# EAGLE design zeta2rework_lw_v28_rework (EAGLE 9.3.1)
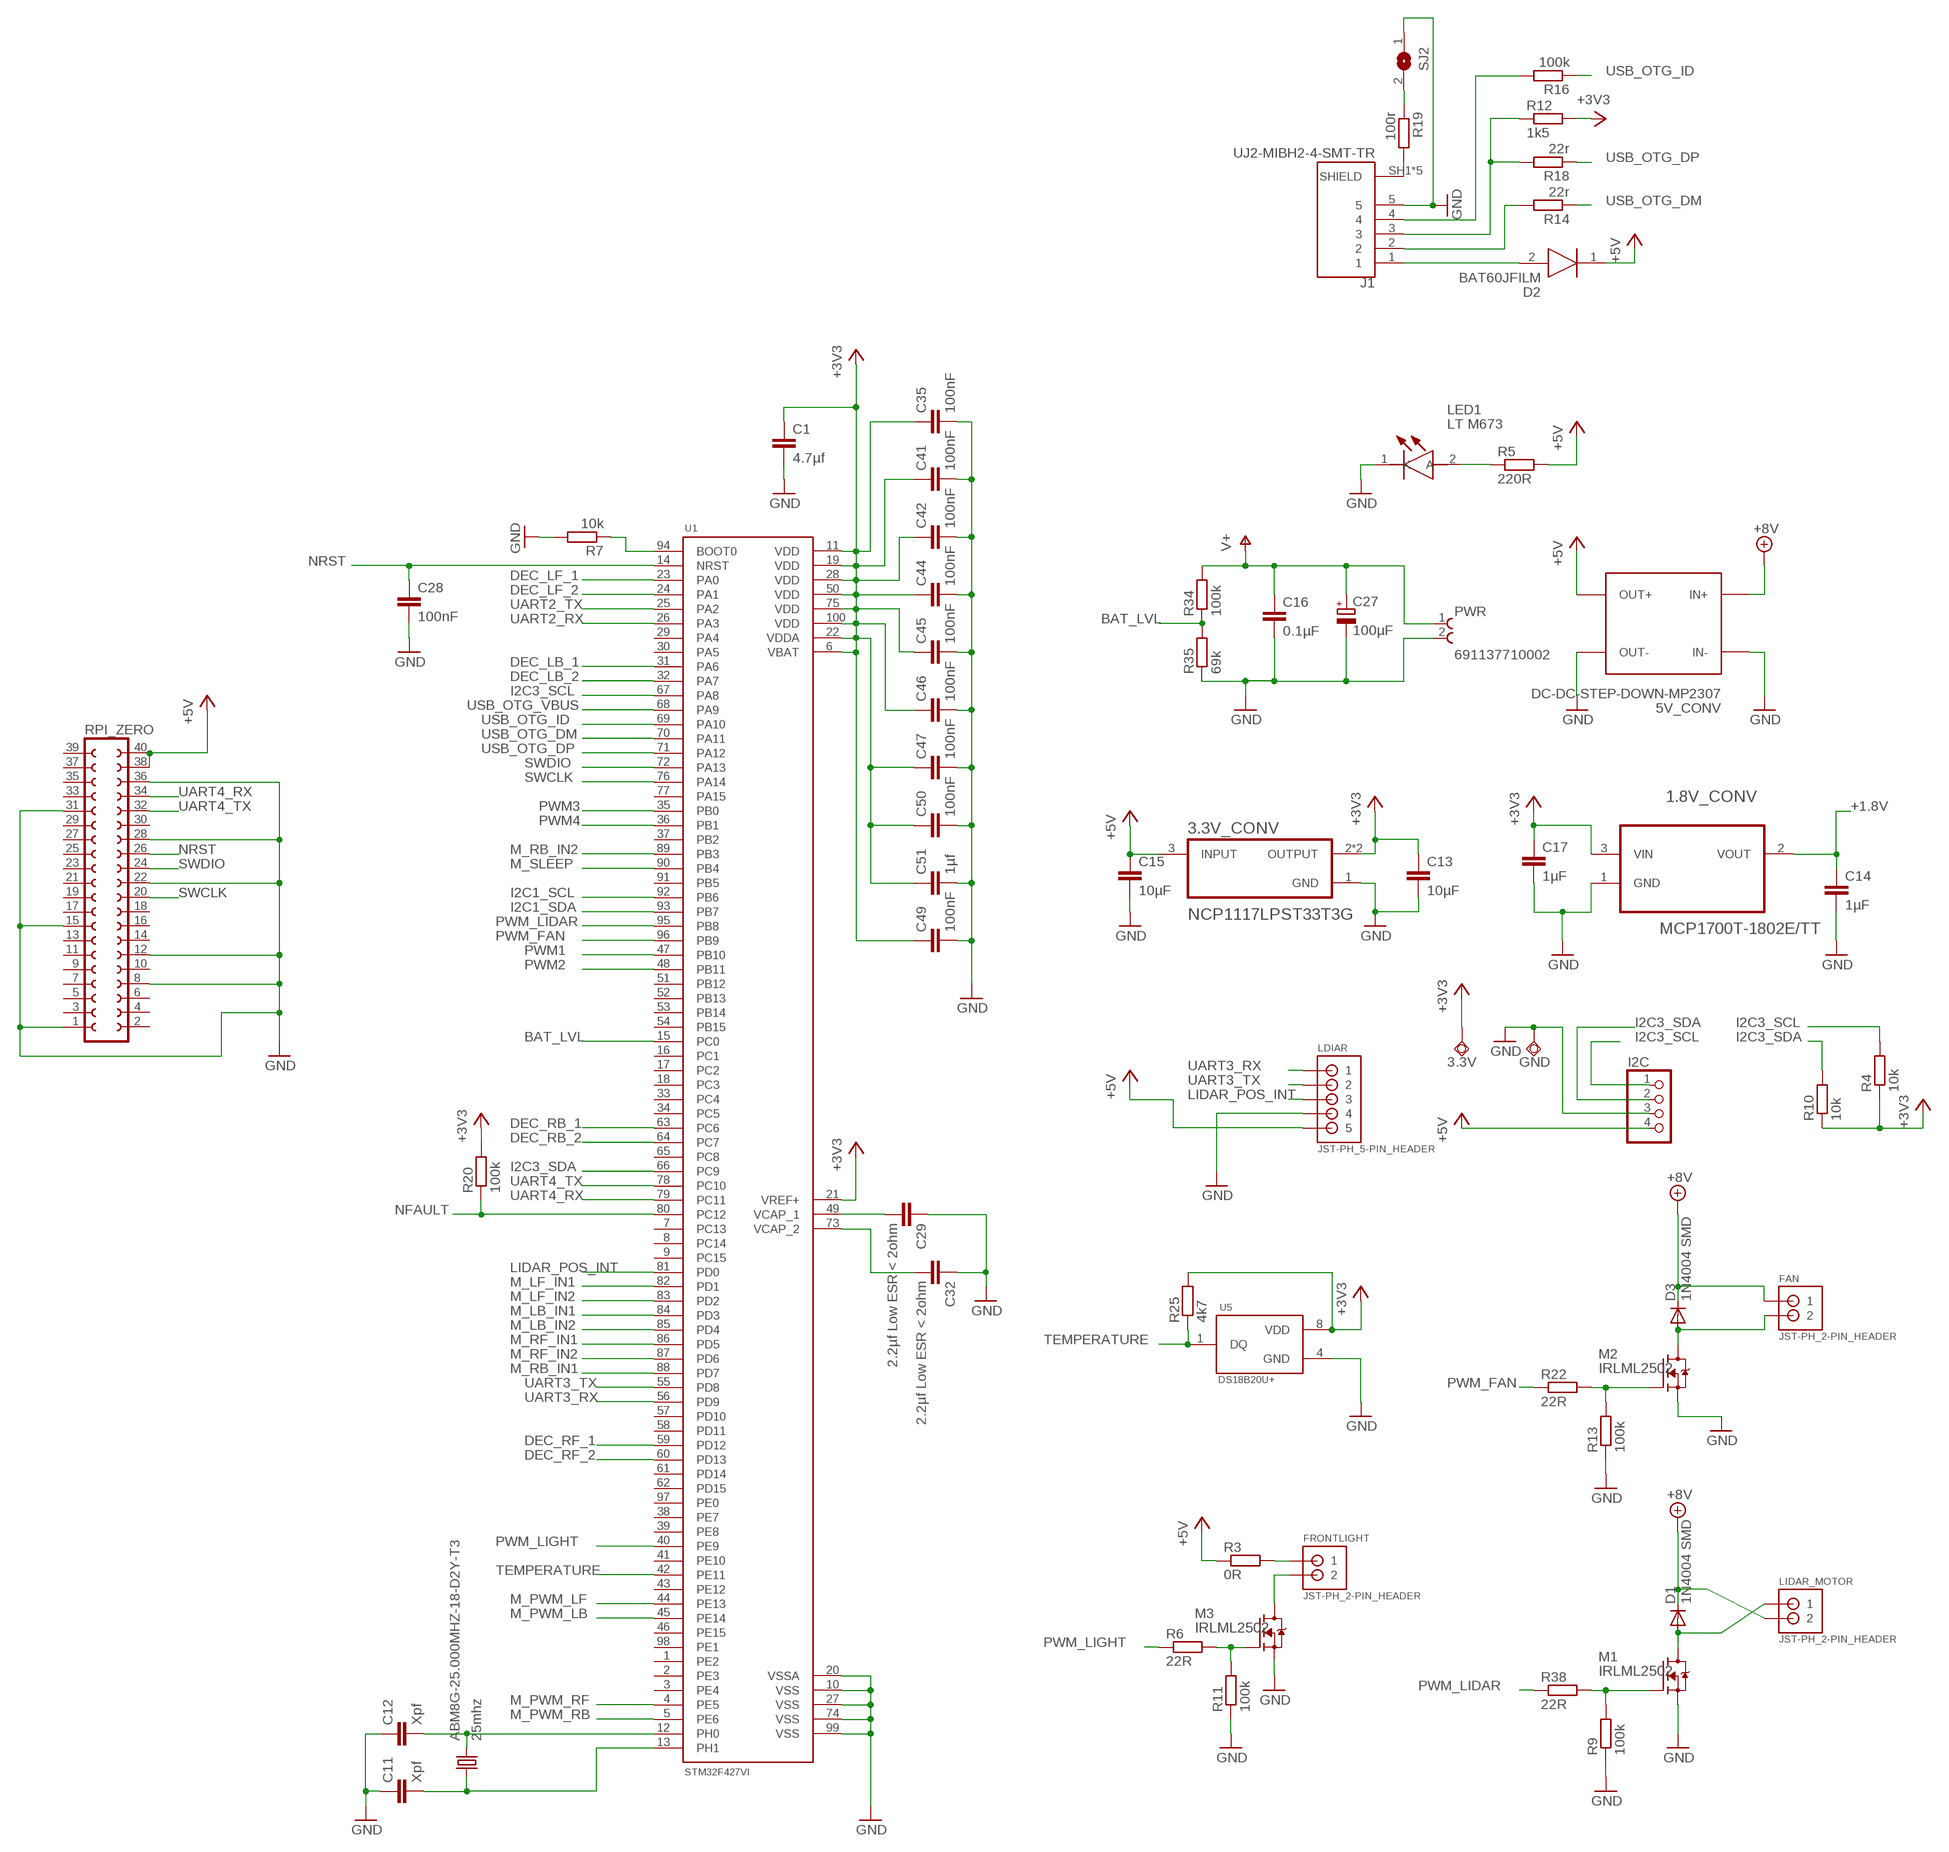
[diagram p0: schematic, sheet 1, part 1 of 2]
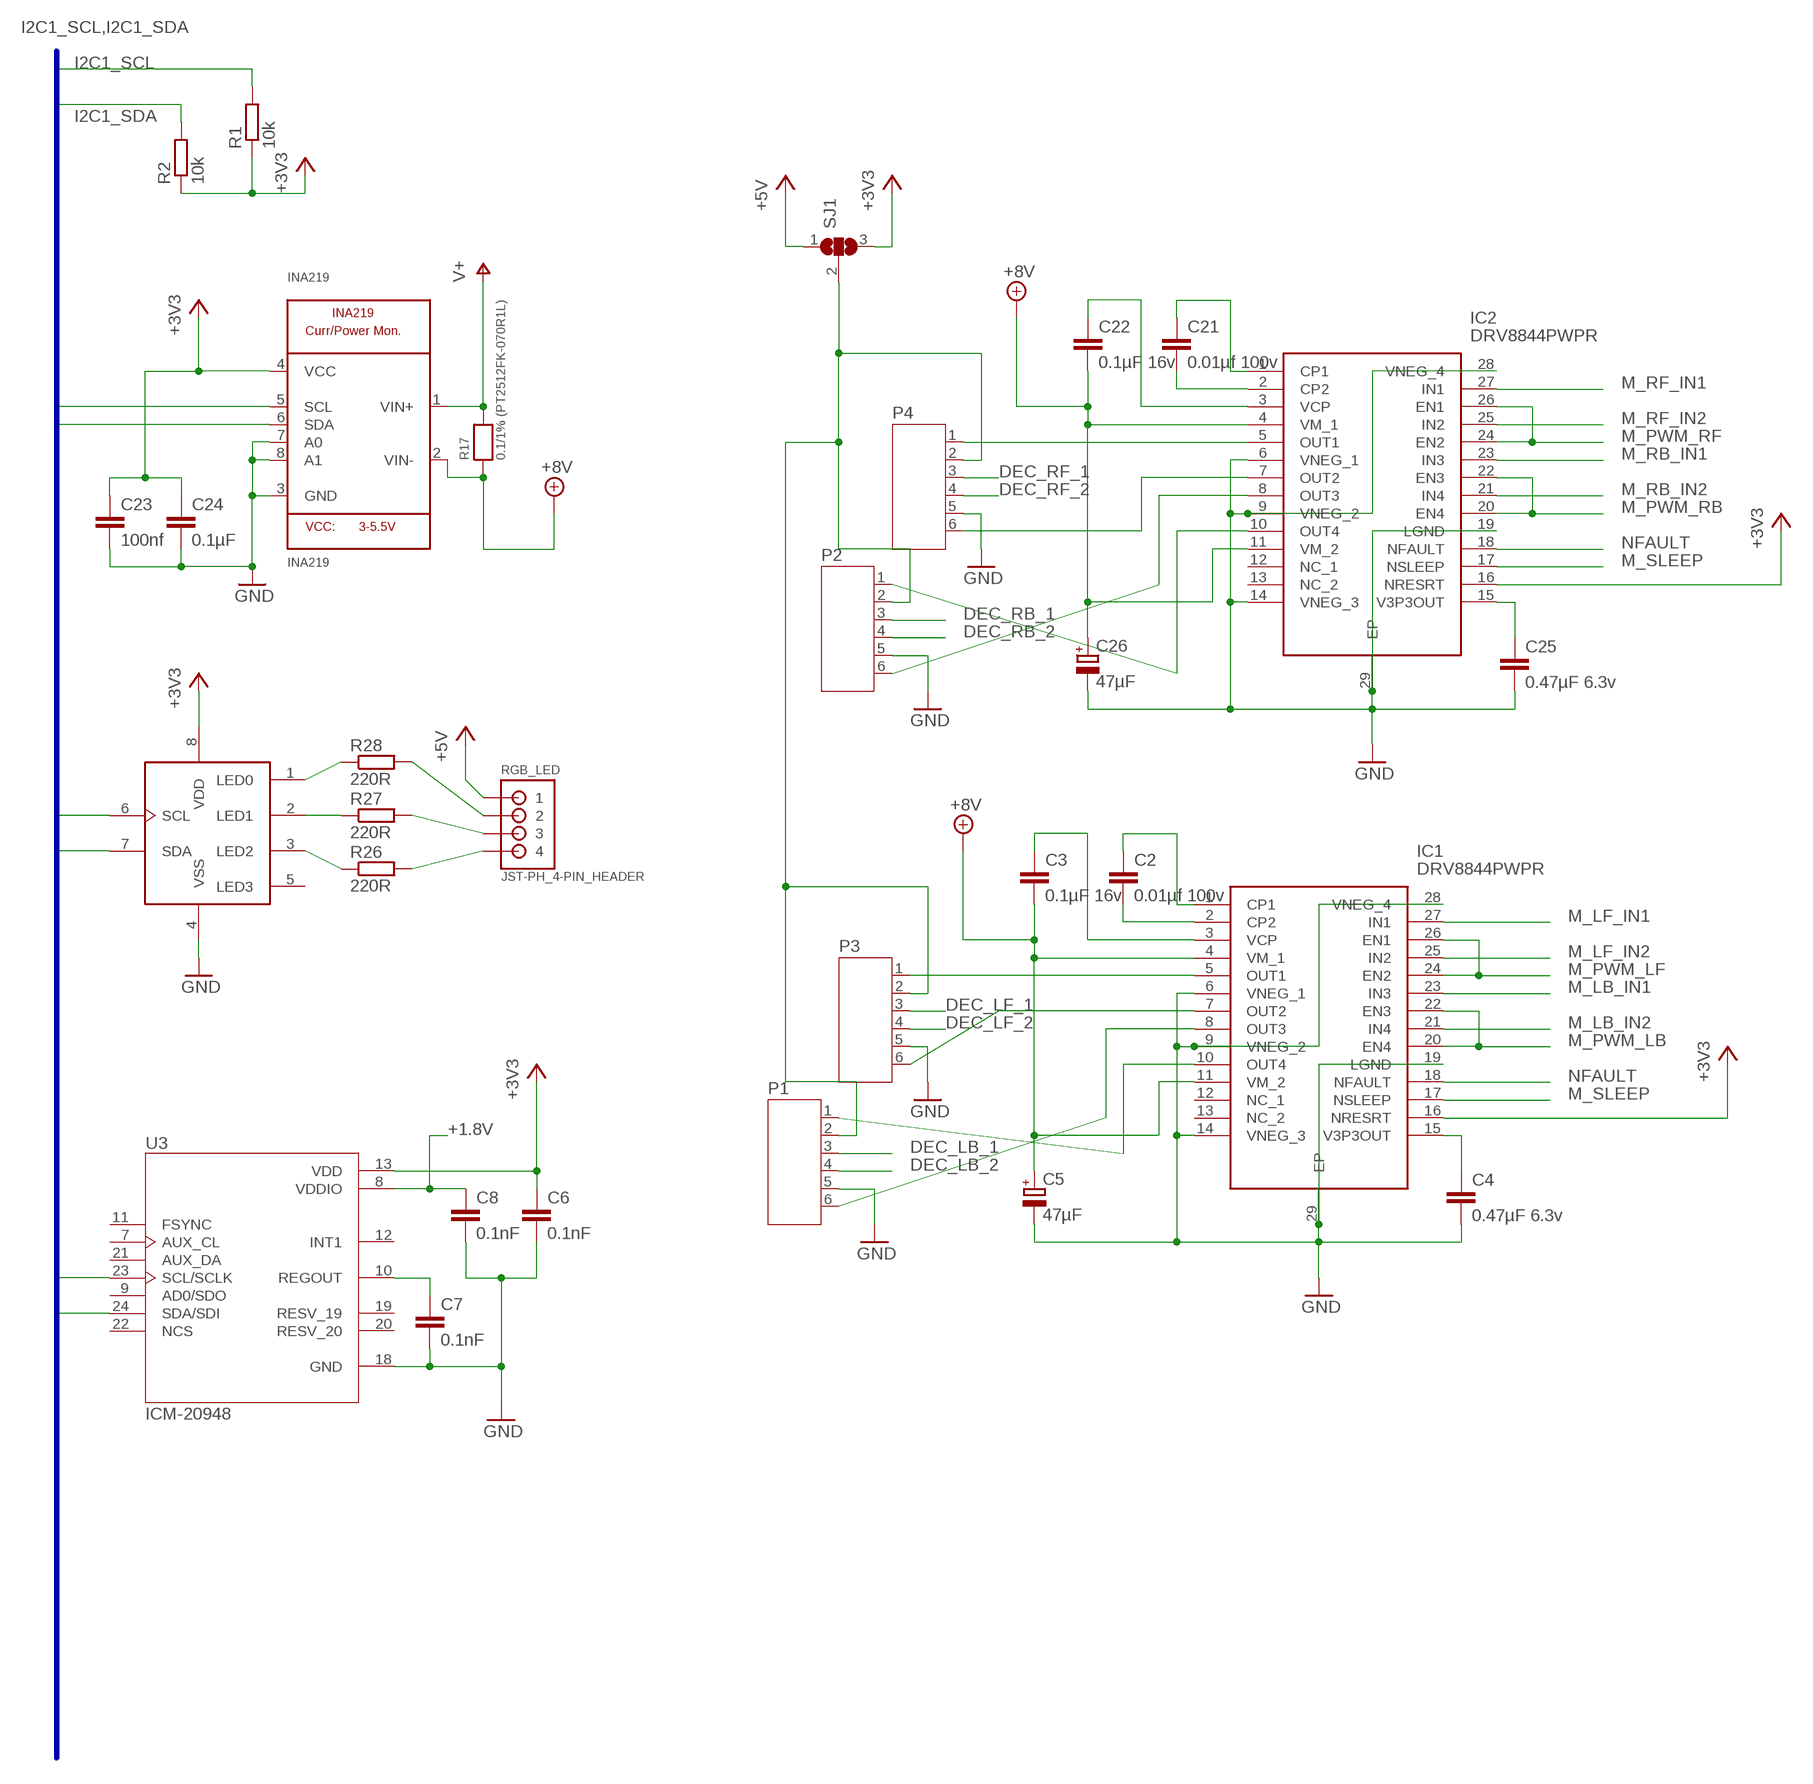
[diagram p1: schematic, sheet 1, part 2 of 2]

## Parts
1.8V_CONV  MCP1700T-1802E/TT  MCP1700T-2102E/TT  [SOT95P237X112-3N]
3.3V  TPSQTP20R  [TP20R]
3.3V_CONV  NCP1117LPST33T3G  [SOT230P700X175-4N]
5V_CONV  DC-DC-STEP-DOWN-MP2307  [DC-DC-STEP-DOWN-MP2307]
ABM8G-25.000MHZ-18-D2Y-T3  25mhz  KX-9A  [5.0X3.2_KX-9A]
C1  4.7µf  C-EUC0603  [C0603]
C2  0.01µf 100v  C-EUC0603  [C0603]
C3  0.1µF 16v  C-EUC0603  [C0603]
C4  0.47µF 6.3v  C-EUC0603  [C0603]
C5  47µF  CPOL-EUUD-5X5,8  [UD-5X5,8_NICHICON]
C6  0.1nF  C-EUC0603  [C0603]
C7  0.1nF  C-EUC0603  [C0603]
C8  0.1nF  C-EUC0603  [C0603]
C11  Xpf  C-EUC0603  [C0603]
C12  Xpf  C-EUC0603  [C0603]
C13  10µF  C-EUC1206  [C1206]
C14  1µF  C-EUC0603  [C0603]
C15  10µF  C-EUC1206  [C1206]
C16  0.1µF  C-EUC0603  [C0603]
C17  1µF  C-EUC0603  [C0603]
C21  0.01µf 100v  C-EUC0603  [C0603]
C22  0.1µF 16v  C-EUC0603  [C0603]
C23  100nf  C-EUC0603  [C0603]
C24  0.1µF  C-EUC0603  [C0603]
C25  0.47µF 6.3v  C-EUC0603  [C0603]
C26  47µF  CPOL-EUUD-5X5,8  [UD-5X5,8_NICHICON]
C27  100µF  CPOL-EUUD-5X5,8  [UD-5X5,8_NICHICON]
C28  100nF  C-EUC0603  [C0603]
C29  2.2µf Low ESR < 2ohm  C-EUC1206  [C1206]
C32  2.2µf Low ESR < 2ohm  C-EUC1206  [C1206]
C35  100nF  C-EUC0603  [C0603]
C41  100nF  C-EUC0603  [C0603]
C42  100nF  C-EUC0603  [C0603]
C44  100nF  C-EUC0603  [C0603]
C45  100nF  C-EUC0603  [C0603]
C46  100nF  C-EUC0603  [C0603]
C47  100nF  C-EUC0603  [C0603]
C49  100nF  C-EUC0603  [C0603]
C50  100nF  C-EUC0603  [C0603]
C51  1µf  C-EUC0603  [C0603]
D1  1N4004 SMD  DIODE-DO214AC  [DO214AC]
D2  BAT60JFILM  [SOD2513X117N]
D3  1N4004 SMD  DIODE-DO214AC  [DO214AC]
FAN  JST-PH_2-PIN_HEADER  [JST_B2B-PH_HEADER]
FRONTLIGHT  JST-PH_2-PIN_HEADER  [JST_B2B-PH_HEADER]
GND  TPSQTP20R  [TP20R]
I2C  PINHD-1X4  [1X04]
IC1  DRV8844PWPR  [SOP65P640X120-29N]
IC2  DRV8844PWPR  [SOP65P640X120-29N]
INA219  INA219  [SOT23-8]
J1  UJ2-MIBH2-4-SMT-TR  [CUI_UJ2-MIBH2-4-SMT-TR]
LDIAR  JST-PH_5-PIN_HEADER  [JST_B5B-PH_HEADER]
LED1  LT M673  LT_M673-N1R2-25  [LTM673-N1R2-25]
LIDAR_MOTOR  JST-PH_2-PIN_HEADER  [JST_B2B-PH_HEADER]
M1  IRLML2502  IRLML2502TRPBF  [SOT23]
M2  IRLML2502  IRLML2502TRPBF  [SOT23]
M3  IRLML2502  IRLML2502TRPBF  [SOT23]
P1  JST-PH6  [JST-PH6]
P2  JST-PH6  [JST-PH6]
P3  JST-PH6  [JST-PH6]
P4  JST-PH6  [JST-PH6]
PCA9533  PCA9533  [SOIC8]
PWR  691137710002  [691137710002]
R1  10k  R-EU_R0603  [R0603]
R2  10k  R-EU_R0603  [R0603]
R3  0R  R-EU_R0603  [R0603]
R4  10k  R-EU_R0603  [R0603]
R5  220R  R-EU_R0603  [R0603]
R6  22R  R-EU_R0603  [R0603]
R7  10k  R-EU_R0603  [R0603]
R9  100k  R-EU_R0603  [R0603]
R10  10k  R-EU_R0603  [R0603]
R11  100k  R-EU_R0603  [R0603]
R12  1k5  R-EU_R0603  [R0603]
R13  100k  R-EU_R0603  [R0603]
R14  22r  R-EU_R0603  [R0603]
R16  100k  R-EU_R0603  [R0603]
R17  0.1/1% (PT2512FK-070R1L)  RESISTOR2512  [2512]
R18  22r  R-EU_R0603  [R0603]
R19  100r  R-EU_R0603  [R0603]
R20  100k  R-EU_R0603  [R0603]
R22  22R  R-EU_R0603  [R0603]
R25  4k7  R-EU_R0603  [R0603]
R26  220R  R-EU_R0603  [R0603]
R27  220R  R-EU_R0603  [R0603]
R28  220R  R-EU_R0603  [R0603]
R34  100k  R-EU_R0603  [R0603]
R35  69k  R-EU_R0603  [R0603]
R38  22R  R-EU_R0603  [R0603]
RGB_LED  JST-PH_4-PIN_HEADER  [JST_B4B-PH_HEADER]
RPI_ZERO  FE20-2  [FE20-2]
SJ1  SJ2W  [SJ_2]
SJ2  SJ  [SJ]
U1  STM32F427VI  STM32F427VGT7  [QFP50P1600X1600X160-100N]
U3  ICM-20948  [QFN40P300X300X105-25N]
U5  DS18B20U+  [SOP65P490X95-8N]

## Nets
+1.8V: 1.8V_CONV.2(VOUT) C8.1 C14.1 U3.8(VDDIO)
+3V3: 1.8V_CONV.3(VIN) 3.3V.TP 3.3V_CONV.2(OUTPUT) 3.3V_CONV.4(OUTPUT) C1.1 C6.1 C13.1 C17.1 C23.1 C24.1 C35.1 C41.1 C42.1 C44.1 C45.1 C46.1 C47.1 C49.1 C50.1 C51.1 IC1.16(NRESRT) IC2.16(NRESRT) INA219.4(VCC) PCA9533.8(VDD) R1.1 R2.1 R4.1 R10.1 R12.2 R20.2 R25.2 SJ1.3 U1.6(VBAT) U1.11(VDD) U1.19(VDD) U1.21(VREF+) U1.22(VDDA) U1.28(VDD) U1.50(VDD) U1.75(VDD) U1.100(VDD) U3.13(VDD) U5.8(VDD)
+5V: 3.3V_CONV.3(INPUT) 5V_CONV.OUT+ C15.1 D2.1(K) I2C.4 LDIAR.P5 R3.1 R5.2 RGB_LED.P1 RPI_ZERO.38 RPI_ZERO.40 SJ1.1
+8V: 5V_CONV.IN+ C3.2 C5.+ C22.2 C26.+ D1.C D3.C FAN.P1 IC1.4(VM_1) IC1.11(VM_2) IC2.4(VM_1) IC2.11(VM_2) INA219.2(VIN-) LIDAR_MOTOR.P2 R17.1
BAT_LVL: R34.1 R35.2 U1.15(PC0)
DEC_LB_1: P1.3 U1.31(PA6)
DEC_LB_2: P1.4 U1.32(PA7)
DEC_LF_1: P3.3 U1.23(PA0)
DEC_LF_2: P3.4 U1.24(PA1)
DEC_RB_1: P2.3 U1.63(PC6)
DEC_RB_2: P2.4 U1.64(PC7)
DEC_RF_1: P4.3 U1.59(PD12)
DEC_RF_2: P4.4 U1.60(PD13)
GND: 1.8V_CONV.1(GND) 3.3V_CONV.1(GND) 5V_CONV.IN- 5V_CONV.OUT- C1.2 C4.2 C5.- C6.2 C7.2 C8.2 C11.1 C12.1 C13.2 C14.2 C15.2 C16.2 C17.2 C23.2 C24.2 C25.2 C26.- C27.- C28.2 C29.1 C32.1 C35.2 C41.2 C42.2 C44.2 C45.2 C46.2 C47.2 C49.2 C50.2 C51.2 GND.TP I2C.3 IC1.6(VNEG_1) IC1.9(VNEG_2) IC1.14(VNEG_3) IC1.19(LGND) IC1.28(VNEG_4) IC1.29(EP) IC2.6(VNEG_1) IC2.9(VNEG_2) IC2.14(VNEG_3) IC2.19(LGND) IC2.28(VNEG_4) IC2.29(EP) INA219.3(GND) INA219.7(A0) INA219.8(A1) J1.5 LDIAR.P4 LED1.1(K) M1.2(S) M2.2(S) M3.2(S) P1.5 P2.5 P3.5 P4.5 PCA9533.4(VSS) PWR.2 R7.2 R9.1 R11.1 R13.1 R35.1 RPI_ZERO.1 RPI_ZERO.8 RPI_ZERO.12 RPI_ZERO.15 RPI_ZERO.22 RPI_ZERO.28 RPI_ZERO.31 RPI_ZERO.36 SJ2.1 U1.10(VSS) U1.20(VSSA) U1.27(VSS) U1.74(VSS) U1.99(VSS) U3.18(GND) U5.4(GND)
I2C1_SCL: INA219.5(SCL) PCA9533.6(SCL) R1.2 U1.92(PB6) U3.23(SCL/SCLK)
I2C1_SDA: INA219.6(SDA) PCA9533.7(SDA) R2.2 U1.93(PB7) U3.24(SDA/SDI)
I2C3_SCL: I2C.1 R4.2 U1.67(PA8)
I2C3_SDA: I2C.2 R10.2 U1.66(PC9)
LIDAR_POS_INT: LDIAR.P3 U1.81(PD0)
M_LB_IN1: IC1.23(IN3) U1.84(PD3)
M_LB_IN2: IC1.21(IN4) U1.85(PD4)
M_LF_IN1: IC1.27(IN1) U1.82(PD1)
M_LF_IN2: IC1.25(IN2) U1.83(PD2)
M_PWM_LB: IC1.20(EN4) IC1.22(EN3) U1.45(PE14)
M_PWM_LF: IC1.24(EN2) IC1.26(EN1) U1.44(PE13)
M_PWM_RB: IC2.20(EN4) IC2.22(EN3) U1.5(PE6)
M_PWM_RF: IC2.24(EN2) IC2.26(EN1) U1.4(PE5)
M_RB_IN1: IC2.23(IN3) U1.88(PD7)
M_RB_IN2: IC2.21(IN4) U1.89(PB3)
M_RF_IN1: IC2.27(IN1) U1.86(PD5)
M_RF_IN2: IC2.25(IN2) U1.87(PD6)
M_SLEEP: IC1.17(NSLEEP) IC2.17(NSLEEP) U1.90(PB4)
N$1: C21.2 IC2.2(CP2)
N$2: C21.1 IC2.1(CP1)
N$3: C22.1 IC2.3(VCP)
N$4: IC2.10(OUT4) P2.1
N$5: J1.3 R12.1 R18.2
N$6: FRONTLIGHT.P1 R3.2
N$7: LED1.2(A) R5.1
N$8: C7.1 U3.10(REGOUT)
N$9: FRONTLIGHT.P2 M3.3(D)
N$10: M3.1(G) R6.2 R11.2
N$11: IC2.5(OUT1) P4.1
N$12: IC2.7(OUT2) P4.6
N$13: ABM8G-25.000MHZ-18-D2Y-T3.1 C11.2 U1.13(PH1)
N$14: IC1.5(OUT1) P3.1
N$15: D2.2(A) J1.1
N$16: R7.1 U1.94(BOOT0)
N$17: J1.4 R16.2
N$18: C2.2 IC1.2(CP2)
N$19: IC2.8(OUT3) P2.6
N$20: C2.1 IC1.1(CP1)
N$21: C3.1 IC1.3(VCP)
N$22: PCA9533.3(LED2) R26.1
N$23: PCA9533.2(LED1) R27.1
N$24: PCA9533.1(LED0) R28.1
N$25: R19.1 SJ2.2
N$26: C25.1 IC2.15(V3P3OUT)
N$27: IC1.7(OUT2) P3.6
N$28: IC1.8(OUT3) P1.6
N$29: C4.1 IC1.15(V3P3OUT)
N$30: IC1.10(OUT4) P1.1
N$31: R26.2 RGB_LED.P4
N$32: P1.2 P2.2 P3.2 P4.2 SJ1.2
N$33: R27.2 RGB_LED.P3
N$34: J1.2 R14.2
N$35: R28.2 RGB_LED.P2
N$36: C29.2 U1.49(VCAP_1)
N$37: M2.1(G) R13.2 R22.2
N$38: M1.1(G) R9.2 R38.2
N$39: D1.A LIDAR_MOTOR.P1 M1.3(D)
N$40: J1.SH1(SHIELD) J1.SH2(SHIELD) J1.SH3(SHIELD) J1.SH4(SHIELD) J1.SH5(SHIELD) R19.2
N$44: ABM8G-25.000MHZ-18-D2Y-T3.3 C12.2 U1.12(PH0)
N$45: C32.2 U1.73(VCAP_2)
N$55: D3.A FAN.P2 M2.3(D)
NFAULT: IC1.18(NFAULT) IC2.18(NFAULT) R20.1 U1.80(PC12)
NRST: C28.1 RPI_ZERO.26 U1.14(NRST)
PWM1: U1.47(PB10)
PWM2: U1.48(PB11)
PWM3: U1.35(PB0)
PWM4: U1.36(PB1)
PWM_FAN: R22.1 U1.96(PB9)
PWM_LIDAR: R38.1 U1.95(PB8)
PWM_LIGHT: R6.1 U1.40(PE9)
SWCLK: RPI_ZERO.20 U1.76(PA14)
SWDIO: RPI_ZERO.24 U1.72(PA13)
TEMPERATURE: R25.1 U1.42(PE11) U5.1(DQ)
UART2_RX: U1.26(PA3)
UART2_TX: U1.25(PA2)
UART3_RX: LDIAR.P1 U1.56(PD9)
UART3_TX: LDIAR.P2 U1.55(PD8)
UART4_RX: RPI_ZERO.34 U1.79(PC11)
UART4_TX: RPI_ZERO.32 U1.78(PC10)
USB_OTG_DM: R14.1 U1.70(PA11)
USB_OTG_DP: R18.1 U1.71(PA12)
USB_OTG_ID: R16.1 U1.69(PA10)
USB_OTG_VBUS: U1.68(PA9)
V+: C16.1 C27.+ INA219.1(VIN+) PWR.1 R17.2 R34.2
Unconnected: IC1.12(NC_1) IC1.13(NC_2) IC2.12(NC_1) IC2.13(NC_2) PCA9533.5(LED3) RPI_ZERO.2 RPI_ZERO.3 RPI_ZERO.4 RPI_ZERO.5 RPI_ZERO.6 RPI_ZERO.7 RPI_ZERO.9 RPI_ZERO.10 RPI_ZERO.11 RPI_ZERO.13 RPI_ZERO.14 RPI_ZERO.16 RPI_ZERO.17 RPI_ZERO.18 RPI_ZERO.19 RPI_ZERO.21 RPI_ZERO.23 RPI_ZERO.25 RPI_ZERO.27 RPI_ZERO.29 RPI_ZERO.30 RPI_ZERO.33 RPI_ZERO.35 RPI_ZERO.37 RPI_ZERO.39 U1.1(PE2) U1.2(PE3) U1.3(PE4) U1.7(PC13) U1.8(PC14) U1.9(PC15) U1.16(PC1) U1.17(PC2) U1.18(PC3) U1.29(PA4) U1.30(PA5) U1.33(PC4) U1.34(PC5) U1.37(PB2) U1.38(PE7) U1.39(PE8) U1.41(PE10) U1.43(PE12) U1.46(PE15) U1.51(PB12) U1.52(PB13) U1.53(PB14) U1.54(PB15) U1.57(PD10) U1.58(PD11) U1.61(PD14) U1.62(PD15) U1.65(PC8) U1.77(PA15) U1.91(PB5) U1.97(PE0) U1.98(PE1) U3.7(AUX_CL) U3.9(AD0/SDO) U3.11(FSYNC) U3.12(INT1) U3.19(RESV_19) U3.20(RESV_20) U3.21(AUX_DA) U3.22(NCS)

## Buses
I2C1_SCL,I2C1_SDA

## Library data of the parts
1.8V_CONV = MCP1700T-2102E_TT:MCP1700T-2102E/TT: Low Quiescent Current LDO; AVAILABILITY: Unavailable; DESCRIPTION: 250mA CMOS LDO, Isupply 1uA and 2% VoutAccuracy; MF: Microchip; MP: MCP1700T-2102E/TT; PACKAGE: SOT-23 Microchip; PRICE: None
3.3V GND = testpad:TPSQ: Test pad
3.3V_CONV = NCP1117LPST33T3G:NCP1117LPST33T3G: None; AVAILABILITY: Unavailable; DESCRIPTION: Linear Voltage Regulator, Positive, LDO, 1.0 A _Fixed and Adjustable_ Vout: 3.3 V; MF: ON Semiconductor; MP: NCP1117LPST33T3G; PACKAGE: SOT-223 ON Semiconductor; PRICE: None
5V_CONV = diy-modules:DC-DC-STEP-DOWN-MP2307: DC/DC Step-Down Regulator based on MP2307DN chip MP2307 datasheet available here: https://cdn-shop.adafruit.com/datasheets/MP2307_r1.9.pdf Click here to find device on ebay.com <http://www.ebay.com/sch/dc+dc+3a+mini+converter>
ABM8G-25.000MHZ-18-D2Y-T3 = crystal-geyer_V1_0:KX: Quartz Crystals (MHz) SMD: KX - Serie Model Size l/w/h [mm] Frequency Range Frequency Stability Temp. Range [°C] Load Capacitance AECQ 200 availabel Datasheet KX-4 KX-5 KX-6 KX-7 KX-9A KX-9B KX-12A KX-12B KX-13 KX-20 KX-K KX-KS 1.6/1.2/0.3 2.0/1.6/0.45 2.5/2.0/0.55 3.2/2.5/0.8 5.0/3.2/1.0 5.0/3.2/1.1 6.0/3.5/1.1 6.0/3.5/1.0 7.0/5.0 /1.3 11.6/5.5/1.6 12.3/4.5/4.2 12.3/4.5/3.2 24.0 ~ 80.0 MHz 16.0 ~ 80.0 MHz 12.0 ~ 80.0 MHz 8.0 ~ 60.0 MHz 7,68 ~ 300,0 MHz 8,0 ~ 50,0 MHz 8,0 ~ 150,0 MHz 8,0 ~ 50,0 MHz 6,0 ~ 160,0 MHz 3,579 ~ 25,0 MHz 3,579 ~ 70,0 MHz 3,579 ~ 70,0 MHz ±10 … ±50ppm ±10 … ±50ppm ±10 … ±50ppm ±10 … ±50ppm ±10 … ±50ppm ±10 … ±50ppm ±10 … ±50ppm ±10 … ±50ppm ±10 … ±50ppm ±50ppm ±10 … ±50ppm ±10 … ±50ppm (*) -40°C …+85°C (*) -40°C …+125°C (*) -40°C …+125°C (*) -40°C …+125°C (*) -40°C …+105°C (*) -40°C …+105°C (*) -40°C …+125°C (*) -40°C …+105°C (*) -40°C …+105°C (*) -40°C …+105°C (*) -40°C …+85°C (*) -40°C …+85°C 8, 8…16 8, 8…16 10, 8…16 12, 7…20 16, 10…20 16, 10…20 16, 10…20 16, 12…20 16, 12…20 16, 12…20 16, 12…30 16, 12…30 - yes yes yes - - - - - - - - KX-4.pdf <http://www.geyer-electronic.de/uploads/tx_userartikelfrequenz/GEYER-KX-4.pdf> KX-5.pdf <http://www.geyer-electronic.de/uploads/tx_userartikelfrequenz/GEYER-KX-5.pdf> KX-6.pdf <http://www.geyer-electronic.de/uploads/tx_userartikelfrequenz/GEYER-KX-6.pdf> KX-7.pdf <http://www.geyer-electronic.de/uploads/tx_userartikelfrequenz/GEYER-KX-7.pdf> KX-9A.pdf <http://www.geyer-electronic.de/uploads/tx_userartikelfrequenz/GEYER-KX-9A.pdf> KX-9B.pdf <http://www.geyer-electronic.de/uploads/tx_userartikelfrequenz/GEYER-KX-9B.pdf> KX-12A.pdf <http://www.geyer-electronic.de/uploads/tx_userartikelfrequenz/GEYER-KX-12A.pdf> KX-12B.pdf <http://www.geyer-electronic.de/uploads/tx_userartikelfrequenz/GEYER-KX-12B.pdf> KX-13.pdf <http://www.geyer-electronic.de/uploads/tx_userartikelfrequenz/GEYER-KX-13.pdf> KX-20.pdf <http://www.geyer-electronic.de/uploads/tx_userartikelfrequenz/GEYER-KX-20.pdf> KX-K.pdf <http://www.geyer-electronic.de/uploads/tx_userartikelfrequenz/GEYER-KX-K.pdf> KX-KS.pdf <http://www.geyer-electronic.de/uploads/tx_userartikelfrequenz/GEYER-KX-KS.pdf> <http://www.geyer-electronic.de/fileadmin/template/img/logo-geyer-electronic.png> Details see: http://www.geyer-electronic.de/Frequenz-Produkte.9.0.html Created 2016-06-07, Hans Locher 2016 (C) Geyer Quartz Technology KX4,KX5,KX6,KX7,KX9A,KX9B,KX12A,KX12B,KX13,KX20,KXK,KXKS;1612;2016;2520;3225;5032;6035;7050;11655;12345;1,6x1,2;2,0x1,6;2,5x2,0;3,2x2,5;5,0x3,2;6,0x3,5;7,0x5,0;11,6x5,5;12,3x4,5;12,3x4,5;1.6x1.2;2.0x1.6;2.5x2.0;3.2x2.5;5.0x3.2;6.0x3.5;7.0x5.0;11.6x5.5;12.3x4.5;12.3x4.5;
C1-C4 C6-C8 C11-C17 C21-C25 C28 C29 C32 C35 C41 C42 C44-C47 C49-C51 = rcl:C-EU: CAPACITOR, European symbol; SPICEPREFIX: C
C5 C26 C27 = rcl:CPOL-EU: POLARIZED CAPACITOR, European symbol; SPICEPREFIX: C
D1 D3 = diode:DIODE-: DIODE
D2 = BAT60JFILM:BAT60JFILM: BAT60JFILM, Schottky Diode, 3A max, 10V, 2-Pin, SOD-323 Source: Datasheet <http://www.st.com/web/en/resource/technical/document/datasheet/CD00001944.pdf>; ALLIED_NUMBER: 70389806; ALLIED_PRICE-STOCK: http://www.alliedelec.com/stmicroelectronics-bat60jfilm/70389806/; DESCRIPTION: BAT60JFILM, Schottky Diode, 3A max, 10V, 2-Pin, SOD-323; HEIGHT: 1.17mm; MANUFACTURER_NAME: STMicroelectronics; MANUFACTURER_PART_NUMBER: BAT60JFILM; MOUSER_PART_NUMBER: 511-BAT60JFILM; MOUSER_PRICE-STOCK: https://www.mouser.com/Search/Refine.aspx?Keyword=511-BAT60JFILM; RS_PART_NUMBER: 1458781; RS_PRICE-STOCK: http://uk.rs-online.com/web/p/products/1458781
FAN FRONTLIGHT LIDAR_MOTOR = srg:JST-PH_2-PIN_HEADER: 2-pin JST PH Shrouded Header, top entry P/N B2B-PH-K-S Mating connector PHR-2 Mating cable assembly: Sparkfun PRT-09914 <http://www.sparkfun.com/products/9914>
I2C = pinhead:PINHD-1X4: PIN HEADER
IC1 IC2 = DRV8844PWPR:DRV8844PWPR: 5A Brushed DC motor or Quad 1.75A Solenoid/Relay Driver with +/-30V split supply support (PWM Ctrl) Source: Datasheet <http://www.ti.com/lit/ds/symlink/drv8844.pdf>; DESCRIPTION: 5A Brushed DC motor or Quad 1.75A Solenoid/Relay Driver with +/-30V split supply support (PWM Ctrl); HEIGHT: 1.2mm; MANUFACTURER_NAME: Texas Instruments; MANUFACTURER_PART_NUMBER: DRV8844PWPR; MOUSER_PART_NUMBER: 595-DRV8844PWPR; MOUSER_PRICE-STOCK: https://www.mouser.com/Search/Refine.aspx?Keyword=595-DRV8844PWPR
INA219 = INA219:INA219: INA219 - I2C Current/Power Monitor Voltage Range: 0-26V Accuracy: 0.5% Temperature: -40°C - 125°C; AVAILABILITY: Unavailable; DESCRIPTION: the ina219 is a high-side current shunt and power monitor with an i2c interface. the ina219 monitors both shunt drop ...; MF: Texas Instruments; MP: INA219; PACKAGE: None; PRICE: None
J1 = UJ2-MIBH2-4-SMT-TR:UJ2-MIBH2-4-SMT-TR: Micro B Type 5 Pin Horizontal 30 µin Plating SMT USB Jack 2.0; AVAILABILITY: Unavailable; CUI_PURCHASE_URL: https://www.cui.com/product/interconnect/usb-connectors/micro-b/uj2-mibh2-4-smt?utm_source=snapeda.com&utm_medium=referral&utm_campaign=snapedaBOM; DESCRIPTION: Micro B Type 5 Pin Horizontal 30 µin Plating SMT USB Jack 2.0; MF: CUI Inc.; MP: UJ2-MIBH2-4-SMT-TR; PACKAGE: None; PRICE: None
LDIAR = srg:JST-PH_5-PIN_HEADER: 5-pin JST PH Shrouded Header, top entry P/N B5B-PH-K-S Mating connector PHR-5 Mating cable assembly: Sparkfun PRT-09917 <http://www.sparkfun.com/products/9917>
LED1 = LT_M673-N1R2-25:LT_M673-N1R2-25: Osram Opto LT M673-N1R2-25, Mini TOPLED Series Green LED, 529 nm,, Rectangle Lens SMD Package Source: Datasheet <https://www.osram-os.com/Graphics/XPic0/00252812_0.pdf/LT M673.pdf>; DESCRIPTION: Osram Opto LT M673-N1R2-25, Mini TOPLED Series Green LED, 529 nm,, Rectangle Lens SMD Package; HEIGHT: mm; MANUFACTURER_NAME: OSRAM Opto Semiconductors; MANUFACTURER_PART_NUMBER: LT M673-N1R2-25; MOUSER_PART_NUMBER: 720-LTM673N1R225Z; MOUSER_PRICE-STOCK: https://www.mouser.com/Search/Refine.aspx?Keyword=720-LTM673N1R225Z; RS_PART_NUMBER: 9133231; RS_PRICE-STOCK: http://uk.rs-online.com/web/p/products/9133231
M1-M3 = IRLML2502TRPBF:IRLML2502TRPBF; AVAILABILITY: Unavailable; DESCRIPTION: Single N-Channel 20 V 0.08 Ohm 12 nC 1.25 W Silicon SMT Mosfet - SOT-23; MF: Infineon; MP: IRLML2502TRPBF; PACKAGE: SOT-23-3 Infineon; PRICE: None
P1-P4 = jst-ph:JST-PH6
PCA9533 = adam - ics:PCA9533: PCA9533D/01: LED driver and dimmer 4 channel, PWM @ 8 bit resolution 25mA / channel sink external resistors per LED I2C protocol @ 400kHz (fast) digikey: 568-3372-5-ND, 8-SOIC, $1.92
PWR = term block:691137710002: SERIE 1377 - 5.00 MM - HORIZONTAL CABLE ENTRY WITH PRESSURE CLAMP - GLOW WIRE PLASTIC - WR-TBL <http://katalog.we-online.de/media/images/v2/Family_WR-TBL1_6911377100xx.jpg> Details see: http://katalog.we-online.de/en/em/TBL_5_00_1377_HORIZONTAL_ENTRY_W_PRESSURE_CLAMP_GLOW_WIRE_6911377100xx Created by Yingchun,Shan 2016(C) Wurth Elektronik; AVAILABILITY: Unavailable; DESCRIPTION: Term Block 2pos Side Entry 5mm; MF: Wurth Electronics; MP: 691137710002; PACKAGE: None; PRICE: None
R1-R7 R9-R14 R16 R18-R20 R22 R25-R28 R34 R35 R38 = rcl:R-EU_: RESISTOR, European symbol; SPICEPREFIX: R
R17 = microbuilder:RESISTOR: Resistors 0402 - 0402 Surface Mount Package 22 Ohm 1% 1/16W [Digikey: 311-22.0LRTR-ND] 33 Ohm 5% 1/16W 1.0K 5% 1/16W 1.5K 5% 1/16W 2.0K 1% 1/16W 10.0K 1% 1/16W [Digikey: 311-10.0KLRTR-ND] 10.0K 5% 1/16W [Digikey: RMCF0402JT10K0TR-ND] 12.1K 1% 1/16W [Digikey: 311-22.0LRTR-ND] 100.0K 5% 1/16W 0603 - 0603 Surface Mount Package 0 Ohm 1/10 Watt 1% Resistor 15 Ohm 1/10 Watt 1% Resistor 33 Ohm 1/10 Watt 1% Resistor 49.9 Ohm 1/10 Watt 1% Resistor 100 Ohm 1/10 Watt 1% Resistor 150 Ohm 1/10 Watt 1% Resistor 240 Ohm 1/10 Watt 1% Resistor 390 Ohm 1/10 Watt 1% Resistor 560 Ohm 1/10 Watt 1% Resistor 680 Ohm 1/10 Watt 1% Resistor 750 Ohm 1/10 Watt 1% Resistor 1.0K Ohm 1/10 Watt 1% Resistor 1.5K Ohm 1/10 Watt 1% Resistor 2.0K Ohm 1/10 Watt 1% Resistor 2.2K Ohm 1/10 Watt 1% Resistor 3.3K Ohm 1/10 Watt 1% Resistor 4.7K Ohm 1/10 Watt 1% Resistor 10.0K Ohm 1/10 Watt 1% Resistor 12.0K Ohm 1/10 Watt 1% Resistor 12.1K Ohm 1/10 Watt 1% Resistor 20.0K Ohm 1/10 Watt 1% Resistor 33.0K Ohm 1/10 Watt 1% Resistor 100.0K Ohm 1/10 Watt 1% Resistor 0805 - 0805 Surface Mount Package 0 Ohm 1/8 Watt 1% Resistor 33 Ohm 1/8 Watt 1% Resistor 100 Ohm 1/8 Watt 1% Resistor 150 Ohm 1/8 Watt 1% Resistor 200 Ohm 1/8 Watt 1% Resistor 240 Ohm 1/8 Watt 1% Resistor 330 Ohm 1/8 Watt 1% Resistor 390 Ohm 1/8 Watt 1% Resistor 470 Ohm 1/8 Watt 1% Resistor 1.0K Ohm 1/8 Watt 1% Resistor 1.5K Ohm 1/8 Watt 1% Resistor 2.0K Ohm 1/8 Watt 1% Resistor 4.7K Ohm 1/8 Watt 1% Resistor 5.1K Ohm 1/8 Watt 1% Resistor 5.6K Ohm 1/8 Watt 1% Resistor 10.0K Ohm 1/8 Watt 1% Resistor 22.0K Ohm 1/8 Watt 1% Resistor 33.0K Ohm 1/8 Watt 1% Resistor 100K Ohm 1/8 Watt 1% Resistor 1206 - 1206 Surface Mount Package 2012 - 2010 Surface Mount Package 0.11 Ohm 1/2 Watt 1% Resistor - Digikey: RHM.11UCT-ND
RGB_LED = srg:JST-PH_4-PIN_HEADER: 4-pin JST PH Shrouded Header, top entry P/N B4B-PH-K-S Mating connector PHR-4 Mating cable assembly: Sparkfun PRT-09916 <http://www.sparkfun.com/products/9916>
RPI_ZERO = con-lsta:FE20-2: FEMALE HEADER; OC_FARNELL: unknown; OC_NEWARK: unknown
SJ1 = jumper:SJ2W: SMD solder JUMPER
SJ2 = jumper:SJ: SMD solder JUMPER
U1 = STM32F427VGT7:STM32F427VGT7: MCU 32-bit STM32F ARM Cortex M4 RISC 1024KB Flash 2.5V/3.3V 100-Pin LQFP Tray; AVAILABILITY: Unavailable; DESCRIPTION: Ic Mcu 32bit 1mb Flash 100lqfp; MF: STMicroelectronics; MP: STM32F427VGT7; PACKAGE: LQFP-100 STMicroelectronics; PRICE: None
U3 = ICM-20948:ICM-20948: Axis=3 Axis Gyro+3 Axis Accel+Compass. Pin For Pin With m; AVAILABILITY: Unavailable; DESCRIPTION: 9 Axis=3 Axis Gyro+3 Axis Accel+Compass. Pin For Pin With m; MF: TDK InvenSense; MP: ICM-20948; PACKAGE: QFN-24 InvenSense; PRICE: None
U5 = DS18B20U_:DS18B20U+: Board Mount Temperature Sensors Prgmble Resolution 1-Wire Parasite Pwr; AVAILABILITY: Unavailable; DESCRIPTION: Date Code: 1043+; RoHS Compliant: Yes;; MF: Maxim; MP: DS18B20U+; PACKAGE: TSSOP-8 Chip Coolers; PRICE: None

## Net classes
0 default: clearance 0.152 mm

## Board
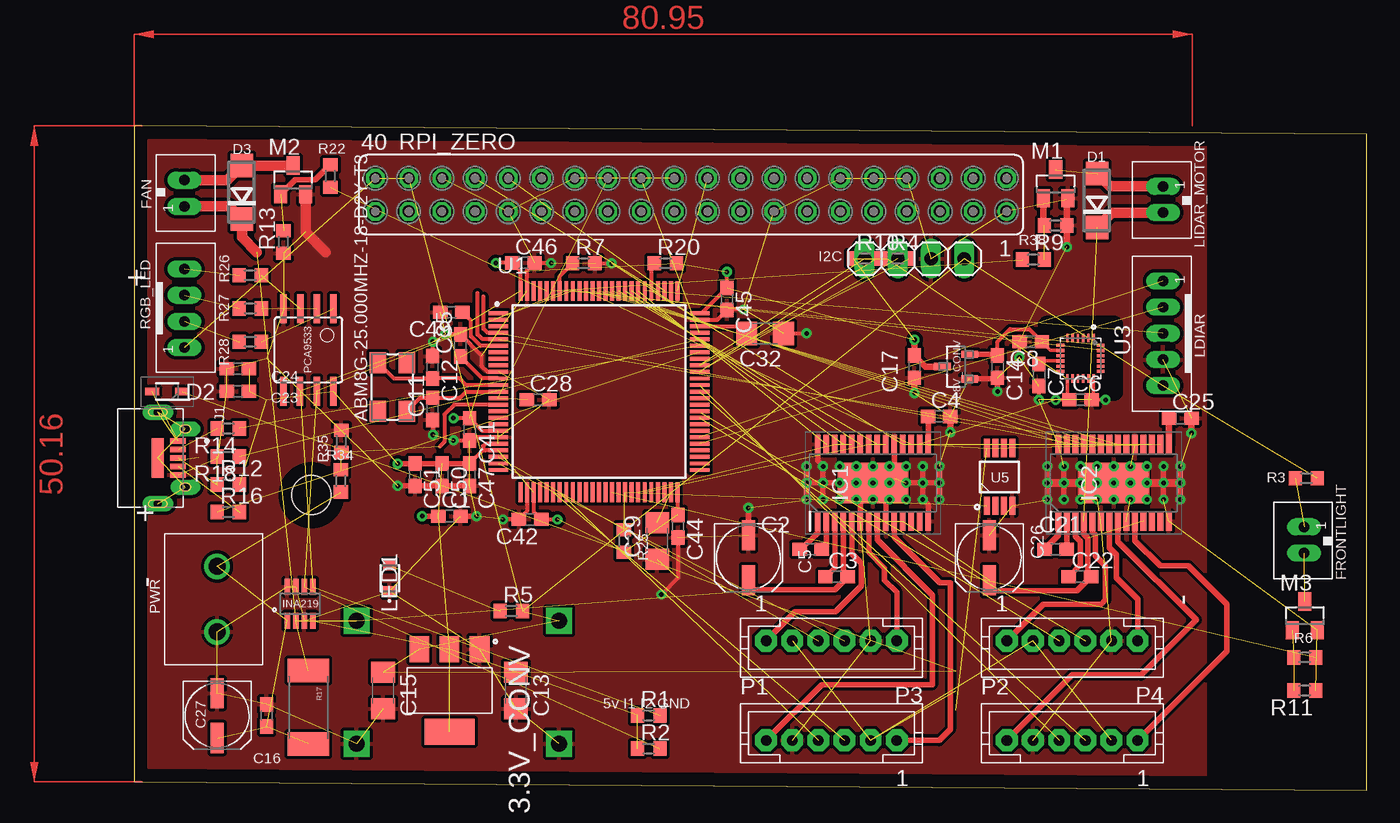
[diagram p2: board, top side]
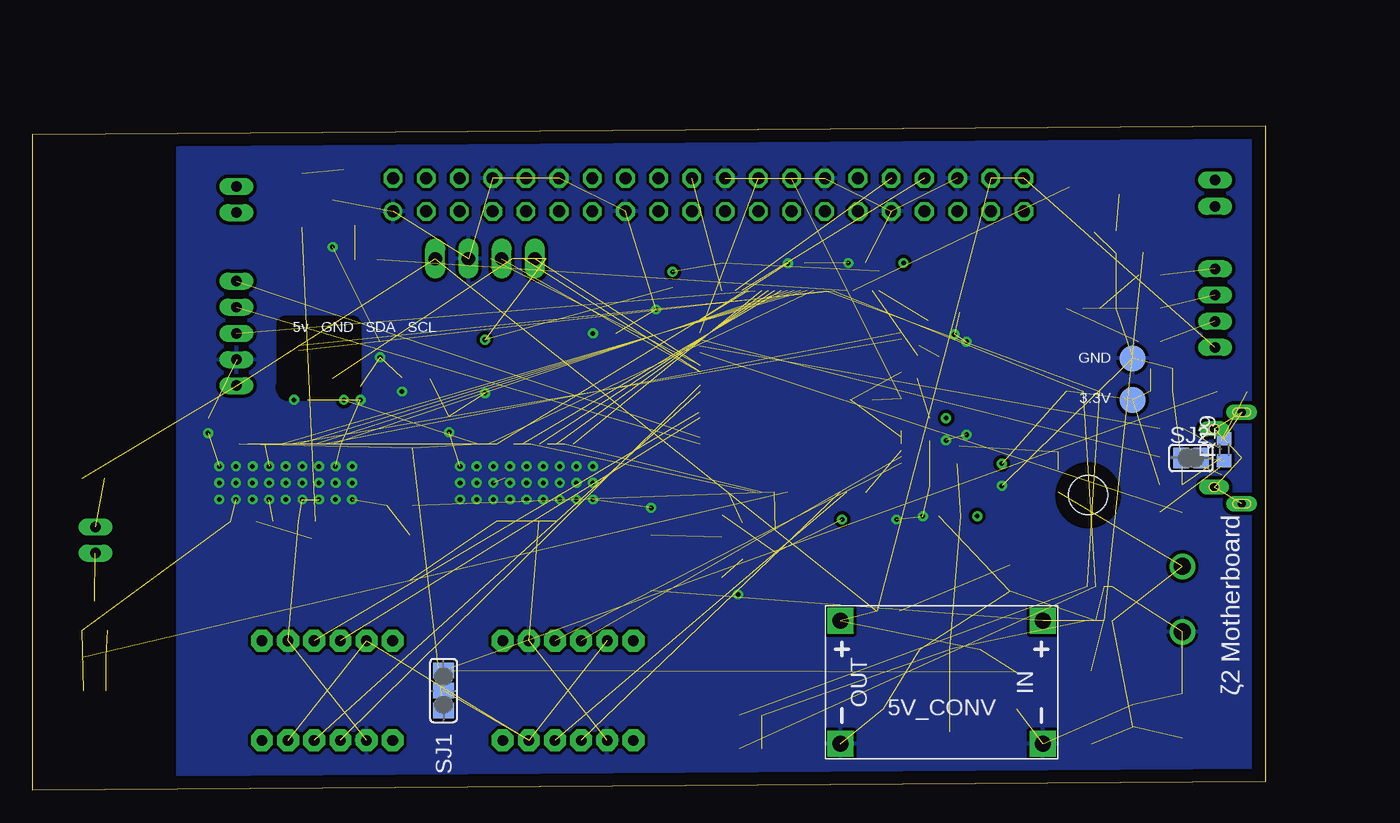
[diagram p3: board, bottom side, seen from below]

Size 94.29 x 50.79 mm. Coordinates in mm from the lower left corner, seen from the top.
Outline: 0,0.64 94.29,0 94.29,50.16 0,50.79 0,0.64
Copper layers (1+2*15+16): Top 0.035mm / dielectric 1.5mm / Route2 0.035mm / dielectric 0.15mm / Route15 0.035mm / dielectric 0.2mm / Bottom 0.035mm
Design rules "default *": minimum track width 6mil, minimum drill 0.35mm, track to track 6mil, track to pad 6mil, pad to pad 6mil, via to via 6mil, smd to smd 6mil, copper to edge 40mil, drill to drill 6mil, minimum pad ring 10mil, minimum via ring 8mil, stop-mask expansion 4mil, vias tented up to drill 0mil, thermal gap 10mil
Holes 3 mm at 13.56,22.56

### Footprints (pad centres in the part's own frame; a part is rotated, then mirrored left to right if it is on the bottom)
SOT95P237X112-3N = smd 0.559 x 1.27: 1 -0.94,-1.041; 2 0.94,-1.041; 3 0,1.041
TP20R = smd 2 x 2: TP 0,0
SOT230P700X175-4N = smd 2 x 1.5: 1 -3.15,2.3; 2 -3.15,0; 3 -3.15,-2.3 | smd 2 x 3.8: 4 3.15,0
DC-DC-STEP-DOWN-MP2307 = drill 1.2 pad 2 square: IN+ -7.747,-4.699; IN- -7.747,4.699; OUT+ 7.747,-4.699; OUT- 7.747,4.699
5.0X3.2_KX-9A = smd 1.6 x 1.25: 1 -1.85,-1.1; 2 1.85,-1.1; 3 1.85,1.1; 4 -1.85,1.1
C0603 = smd 1.1 x 1: 1 -0.85,0; 2 0.85,0
UD-5X5,8_NICHICON = smd 2.3 x 1: + 1.725,0; - -1.7,0
C1206 = smd 1.6 x 1.8: 1 -1.4,0; 2 1.4,0
DO214AC = smd 1.8 x 1.7: A 2.05,0; C -2.05,0
SOD2513X117N = smd 1.085 x 0.55: 1 -1.14,0; 2 1.14,0
JST_B2B-PH_HEADER = drill 0.8 long: P1 1.075,0.048; P2 -0.925,0.048
1X04 = drill 1.016 long: 1 -3.81,0; 2 -1.27,0; 3 1.27,0; 4 3.81,0
SOP65P640X120-29N = smd 1.475 x 0.45: 1 -2.938,4.225; 2 -2.938,3.575; 3 -2.938,2.925; 4 -2.938,2.275; 5 -2.938,1.625; 6 -2.938,0.975; 7 -2.938,0.325; 8 -2.938,-0.325; 9 -2.938,-0.975; 10 -2.938,-1.625; 11 -2.938,-2.275; 12 -2.938,-2.925; 13 -2.938,-3.575; 14 -2.938,-4.225; 15 2.938,-4.225; 16 2.938,-3.575; 17 2.938,-2.925; 18 2.938,-2.275; 19 2.938,-1.625; 20 2.938,-0.975; 21 2.938,-0.325; 22 2.938,0.325; 23 2.938,0.975; 24 2.938,1.625; 25 2.938,2.275; 26 2.938,2.925; 27 2.938,3.575; 28 2.938,4.225 | smd 3.1 x 5.18: 29 0,0
SOT23-8 = smd 0.4 x 1.2: 1 -0.975,-1.3; 2 -0.325,-1.3; 3 0.325,-1.3; 4 0.975,-1.3; 5 0.975,1.3; 6 0.325,1.3; 7 -0.325,1.3; 8 -0.975,1.3
CUI_UJ2-MIBH2-4-SMT-TR = smd 0.4 x 1.2: 1 -1.3,2.1; 2 -0.65,2.1; 3 0,2.1; 4 0.65,2.1; 5 1.3,2.1 | drill 0.6 pad 1.2 long: SH1 -3.5,0.55; SH4 3.5,0.55 | drill 0.65 pad 1.1 long: SH2 -2.225,2.65; SH3 2.225,2.65 | smd 3 x 0.9: SH5 0,0.55
JST_B5B-PH_HEADER = drill 0.8 long: P1 4,0.048; P2 2,0.048; P3 0,0.048; P4 -2,0.048; P5 -4,0.048
LTM673-N1R2-25 = smd 0.8 x 1: 1 -1,0; 2 1,0
SOT23 = smd 1 x 1.4: 1 -0.95,-1.1; 2 0.95,-1.1; 3 0,1.1
JST-PH6 = drill 0.813 pad 1.676 octagon: 1 5,0; 2 3,0; 3 1,0; 4 -1,0; 5 -3,0; 6 -5,0
SOIC8 = smd 0.5 x 2.2: 1 -1.905,-3.154; 2 -0.645,-3.154; 3 0.625,-3.154; 4 1.895,-3.154; 5 1.905,3.154; 6 0.635,3.154; 7 -0.635,3.154; 8 -1.905,3.154
691137710002 = drill 1.3: 1 -2.5,0; 2 2.5,0
R0603 = smd 1 x 1.1: 1 -0.85,0; 2 0.85,0
2512 = smd 1.8 x 3.2: 1 -2.8,0; 2 2.8,0
JST_B4B-PH_HEADER = drill 0.8 long: P1 2.98,0.048; P2 0.98,0.048; P3 -1.02,0.048; P4 -3.02,0.048
FE20-2 = drill 0.914: 1 -24.13,1.27 | drill 0.914 octagon: 2 -24.13,-1.27; 3 -21.59,1.27; 4 -21.59,-1.27; 5 -19.05,1.27; 6 -19.05,-1.27; 7 -16.51,1.27; 8 -16.51,-1.27; 9 -13.97,1.27; 10 -13.97,-1.27; 11 -11.43,1.27; 12 -11.43,-1.27; 13 -8.89,1.27; 14 -8.89,-1.27; 15 -6.35,1.27; 16 -6.35,-1.27; 17 -3.81,1.27; 18 -3.81,-1.27; 19 -1.27,1.27; 20 -1.27,-1.27; 21 1.27,1.27; 22 1.27,-1.27; 23 3.81,1.27; 24 3.81,-1.27; 25 6.35,1.27; 26 6.35,-1.27; 27 8.89,1.27; 28 8.89,-1.27; 29 11.43,1.27; 30 11.43,-1.27; 31 13.97,1.27; 32 13.97,-1.27; 33 16.51,1.27; 34 16.51,-1.27; 35 19.05,1.27; 36 19.05,-1.27; 37 21.59,1.27; 38 21.59,-1.27; 39 24.13,1.27; 40 24.13,-1.27
SJ_2 = smd 1.168 x 1.6: 1 -1.524,0; 2 0,0; 3 1.524,0
SJ = smd 1.168 x 1.6: 1 -0.762,0; 2 0.762,0
QFP50P1600X1600X160-100N = smd 1.5 x 0.3: 1 -7.7,6; 2 -7.7,5.5; 3 -7.7,5; 4 -7.7,4.5; 5 -7.7,4; 6 -7.7,3.5; 7 -7.7,3; 8 -7.7,2.5; 9 -7.7,2; 10 -7.7,1.5; 11 -7.7,1; 12 -7.7,0.5; 13 -7.7,0; 14 -7.7,-0.5; 15 -7.7,-1; 16 -7.7,-1.5; 17 -7.7,-2; 18 -7.7,-2.5; 19 -7.7,-3; 20 -7.7,-3.5; 21 -7.7,-4; 22 -7.7,-4.5; 23 -7.7,-5; 24 -7.7,-5.5; 25 -7.7,-6; 51 7.7,-6; 52 7.7,-5.5; 53 7.7,-5; 54 7.7,-4.5; 55 7.7,-4; 56 7.7,-3.5; 57 7.7,-3; 58 7.7,-2.5; 59 7.7,-2; 60 7.7,-1.5; 61 7.7,-1; 62 7.7,-0.5; 63 7.7,0; 64 7.7,0.5; 65 7.7,1; 66 7.7,1.5; 67 7.7,2; 68 7.7,2.5; 69 7.7,3; 70 7.7,3.5; 71 7.7,4; 72 7.7,4.5; 73 7.7,5; 74 7.7,5.5; 75 7.7,6 | smd 0.3 x 1.5: 26 -6,-7.7; 27 -5.5,-7.7; 28 -5,-7.7; 29 -4.5,-7.7; 30 -4,-7.7; 31 -3.5,-7.7; 32 -3,-7.7; 33 -2.5,-7.7; 34 -2,-7.7; 35 -1.5,-7.7; 36 -1,-7.7; 37 -0.5,-7.7; 38 0,-7.7; 39 0.5,-7.7; 40 1,-7.7; 41 1.5,-7.7; 42 2,-7.7; 43 2.5,-7.7; 44 3,-7.7; 45 3.5,-7.7; 46 4,-7.7; 47 4.5,-7.7; 48 5,-7.7; 49 5.5,-7.7; 50 6,-7.7; 76 6,7.7; 77 5.5,7.7; 78 5,7.7; 79 4.5,7.7; 80 4,7.7; 81 3.5,7.7; 82 3,7.7; 83 2.5,7.7; 84 2,7.7; 85 1.5,7.7; 86 1,7.7; 87 0.5,7.7; 88 0,7.7; 89 -0.5,7.7; 90 -1,7.7; 91 -1.5,7.7; 92 -2,7.7; 93 -2.5,7.7; 94 -3,7.7; 95 -3.5,7.7; 96 -4,7.7; 97 -4.5,7.7; 98 -5,7.7; 99 -5.5,7.7; 100 -6,7.7
QFN40P300X300X105-25N = smd 0.64 x 0.22: 1 -1.545,1; 2 -1.545,0.6; 3 -1.545,0.2; 4 -1.545,-0.2; 5 -1.545,-0.6; 6 -1.545,-1; 13 1.545,-1; 14 1.545,-0.6; 15 1.545,-0.2; 16 1.545,0.2; 17 1.545,0.6; 18 1.545,1 | smd 0.22 x 0.64: 7 -1,-1.545; 8 -0.6,-1.545; 9 -0.2,-1.545; 10 0.2,-1.545; 11 0.6,-1.545; 12 1,-1.545; 19 1,1.545; 20 0.6,1.545; 21 0.2,1.545; 22 -0.2,1.545; 23 -0.6,1.545; 24 -1,1.545
SOP65P490X95-8N = smd 1.4 x 0.45: 1 -2.2,0.975; 2 -2.2,0.325; 3 -2.2,-0.325; 4 -2.2,-0.975; 5 2.2,-0.975; 6 2.2,-0.325; 7 2.2,0.325; 8 2.2,0.975

### Placement (x,y rotation side)
1.8V_CONV  62.86,32.38 90 top
3.3V  10.16,29.84 0 bottom
3.3V_CONV  24.13,7.62 270 top
5V_CONV  24.77,8.26 180 bottom
ABM8G-25.000MHZ-18-D2Y-T3  19.76,30.84 90 top
C1  24.13,20.95 0 top
C2  51.75,18.41 0 top
C3  53.73,16.31 0 top
C4  61.58,28.57 0 top
C5  46.99,17.78 270 top
C6  72.39,29.84 0 top
C7  69.22,31.75 270 top
C8  68.58,34.29 180 top
C11  22.83,29.16 90 top
C12  22.83,32.33 270 top
C13  29.21,7.62 270 top
C14  66.04,32.38 270 top
C15  19.05,7.62 270 top
C16  10.16,5.71 90 top
C17  59.69,32.38 270 top
C21  70.48,18.41 0 top
C22  72.34,16.33 0 top
C23  7.95,30.51 180 top
C24  7.95,32.23 180 top
C25  80.02,28.45 0 top
C26  65.41,17.78 270 top
C27  6.35,5.71 270 top
C28  30.9,29.84 0 top
C29  40,19.05 90 top
C32  48.26,34.92 180 top
C35  24.97,34 90 top
C41  25.68,27.58 270 top
C42  30.29,20.7 180 top
C44  41.61,20.18 270 top
C45  45.34,37.55 270 top
C46  29.78,40.31 0 top
C47  25.65,24.12 270 top
C49  24.27,36.55 180 top
C50  23.57,24.12 270 top
C51  21.49,24.12 270 top
D1  73.66,45.09 90 top
D2  2.54,30.48 180 top
D3  8.26,45.72 90 top
FAN  3.81,45.72 270 top
FRONTLIGHT  89.54,19.05 90 top
GND  10.16,33.02 0 bottom
I2C  59.69,40.64 0 top
IC1  56.52,23.49 90 top
IC2  74.93,23.49 90 top
INA219  12.7,14.25 0 top
J1  1.27,25.4 270 top
LDIAR  78.74,34.92 90 top
LED1  19.56,16.21 90 top
LIDAR_MOTOR  78.74,45.09 90 top
M1  70.48,46.35 0 top
M2  12.17,46.66 0 top
M3  89.54,13.33 0 top
P1  53.34,3.81 0 top
P2  71.76,3.81 0 top
P3  53.34,11.43 180 top
P4  71.76,11.43 180 top
PCA9533  13.33,33.66 180 top
PWR  6.35,14.6 270 top
R1  39.37,5.71 0 top
R2  39.37,3.18 0 top
R3  89.66,23.85 180 top
R4  58.42,40.64 0 top
R5  28.85,13.69 0 top
R6  89.54,10.16 180 top
R7  34.39,40.28 0 top
R9  70.48,43.18 180 top
R10  55.88,40.64 0 top
R11  89.54,7.62 180 top
R12  7.21,23.37 0 top
R13  11.43,41.91 90 top
R14  7.21,27.66 180 top
R16  7.21,21.26 0 top
R17  13.33,6.35 270 top
R18  7.21,25.5 180 top
R19  3.17,26.03 90 bottom
R20  40.64,40.28 0 top
R22  15.01,46.96 90 top
R25  37.46,19.05 270 top
R26  8.89,39.37 180 top
R27  8.89,36.83 180 top
R28  8.89,34.29 180 top
R34  15.82,23.65 270 top
R35  15.85,26.67 270 top
R38  68.78,40.56 0 top
RGB_LED  3.81,36.83 270 top
RPI_ZERO  42.6,45.52 180 top
SJ1  62.86,7.62 270 bottom
SJ2  5.69,25.4 0 bottom
U1  35.56,30.48 0 top
U3  72.39,33.02 270 top
U5  66.19,23.95 90 top

### Tracks (layer width: path | path; a pad name or v marks a point on that pad's centre or on a via)
+1.8V
  Top 0.254: C8.1 70.1,33.62 U3.8
  Top 0.305: C14.1 66.04,34.29 67.01,35.25 68.47,35.25 C8.1
  Top 0.406: 1.8V_CONV.2 65.95,33.32 C14.1
+3V3  (via drill 0.35)  (29 unrouted)
  Top 0.254: U3.13 71.39,29.99 C6.1 v70.48,29.84
  Top 0.305: U1.28 30.56,21.28 C42.1 v32.38,20.7 | U1.50 41.56,21.08 C44.1 | U1.75 43.42,36.48 C45.1 v45.34,39.62 | U1.100 29.56,39.68 C46.1 v27.69,40.31 | U1.11 26.64,31.48 C35.1 | U1.6 26.5,33.98 25.77,34.7 25.77,35.9 C49.1 | v24.44,28.45 24.45,28.43 C41.1 26.63,27.48 U1.19 | U1.21 26.86,26.48 26.7,26.31 26.7,26.14 26.73,26.1 | U1.22 26.85,25.98 26.73,26.1 | 25.74,25.06 26.73,26.05 26.73,26.1
  Top 0.406: 25.74,25.06 C47.1 C50.1 C51.1 v20.17,24.97 | C1.1 v22.05,20.95
  Top 0.508: 1.8V_CONV.3 60.54,32.38 C17.1 v59.69,34.44
+5V  (11 unrouted)
+8V  (8 unrouted)
  Top 0.406: IC1.4 54.24,16.65 C3.2 53.62,15.34 47.09,15.34 46.99,15.24 C5.+ | IC2.4 72.66,19.58 72.95,19.28 72.95,16.57 C22.2 72.1,15.24 65.41,15.24 C26.+
  Top 0.813: FAN.P1 7.28,44.64 D3.C 8.26,42.27 9.37,41.15 | LIDAR_MOTOR.P2 74.79,44.16 D1.C
BAT_LVL  (2 unrouted)
  Top 0.305: 23.39,26.29 23.75,26.65 23.75,28.73 24.5,29.48 U1.15
DEC_LB_1  (1 unrouted)
DEC_LB_2  (1 unrouted)
DEC_LF_1  (1 unrouted)
DEC_LF_2  (1 unrouted)
DEC_RB_1  (1 unrouted)
DEC_RB_2  (1 unrouted)
DEC_RF_1  (1 unrouted)
DEC_RF_2  (1 unrouted)
  Top 0.152: U1.60 43.38,28.86
GND  (via drill 0.35)  (71 unrouted)
  Top 0.254: U3.18 73.39,29.99 C6.2 v74.3,29.84 | C7.2 v69.22,29.84 | C8.2 67.73,33.11 v67.72,33.1
  Top 0.305: U1.27 30.06,21.32 C42.2 v28.22,20.7 | U1.74 44.62,35.98 C45.2 45.39,36.75 v46.61,36.75 | U1.99 30.06,39.74 C46.2 v31.9,40.31 | U1.10 27.03,31.98 26.59,32.42 26.59,33.23 C35.2 v23.8,34.85 | C12.1 22.86,33.21 v22.86,34.29 | 25.7,26.75 C41.2 | C41.2 24.44,26.73 v24.44,26.75 | C44.2 41.6,16.23 v40.34,14.96 | R7.2 v36.52,40.28 | C11.1 22.86,28.28 v22.86,27.18 | U1.20 25.93,26.98 C41.2 | C32.1 v51.43,34.92
  Top 0.406: IC1.19 58.14,23.85 v57.78,23.49 | v55.24,23.49 v53.98,23.49 | v52.7,23.49 v52.7,24.77 52.29,25.18 IC1.28 | v52.7,23.49 v52.7,22.23 | v51.43,24.77 v51.43,23.49 | v51.43,23.49 v51.43,22.23 | v60.32,24.77 v60.32,23.49 | v60.32,23.49 v60.32,22.23 60.74,21.81 IC1.14 | v61.59,24.77 v61.59,23.49 | v61.59,23.49 v61.59,22.23 | v59.05,24.77 v59.05,23.49 | v59.05,23.49 v59.05,22.23 | v57.78,24.77 v57.78,23.49 | v57.78,23.49 v57.78,22.23 57.49,21.93 IC1.9 | v56.52,24.77 IC1.29 | IC1.29 v56.52,22.23 | v55.24,24.77 v55.24,23.49 | v55.24,23.49 v55.24,22.23 55.54,21.93 IC1.6 | v53.98,24.77 v53.98,23.49 | v53.98,23.49 v53.98,22.23 | v51.43,23.49 v52.7,23.49 | v52.7,23.49 v53.98,23.49 | IC1.29 v55.24,23.49 | v60.32,23.49 v59.05,23.49 | v61.59,23.49 v60.32,23.49 | IC1.29 v57.78,23.49 | C5.- v46.99,21.59 | 1.8V_CONV.1 65.95,31.45 C14.2 v66.04,30.48 | v69.85,24.77 v69.85,23.49 v69.85,22.23 | v71.12,24.77 v71.12,23.49 v71.12,22.23 | v72.39,24.77 v72.39,23.49 v72.39,22.23 | v73.66,24.77 v73.66,23.49 v73.66,22.23 | v74.93,24.77 IC2.29 v74.93,22.23 | v76.2,24.77 v76.2,23.49 v76.2,22.23 | v77.47,24.77 v77.47,23.49 v77.47,22.23 | v78.74,24.77 v78.74,23.49 v78.74,22.23 | v80.01,24.77 v80.01,23.49 v80.01,22.23 | C47.2 C50.2 C51.2 v20.17,23.27 | C1.2 v26.21,20.95
  Top 0.508: C17.2 v59.69,30.35 | M1.2 71.34,45.16 R9.1 71.34,41.54 v71.35,41.53 | C25.2 v80.87,27.3 | C4.2 v62.43,27.38
  Top 0.61: v69.85,23.49 v71.12,23.49 v72.39,23.49 | IC2.29 v73.66,23.49 | IC2.29 v76.2,23.49 | IC2.29 v77.47,23.49 | IC2.29 v78.74,23.49 v80.01,23.49
  Top 0.813: M2.2 13.12,42.69 14.66,41.15
  other vias: 56.52,23.49 74.93,23.49
  pour Top (isolate 0.254, rank 3): -1.27,51.43 -1.27,0 81.92,0 81.92,51.43
  pour Bottom (isolate 0.254, rank 3): -2.54,-1.27 -2.54,52.7 83.19,52.7 83.19,-1.27
  cutout Top: 74.93,36.2 69.85,36.2 arc90 69.22,35.56 69.22,30.48 arc90 69.85,29.84 74.93,29.84 arc90 75.57,30.48 75.57,35.56 arc90
  cutout Bottom: 75.57,31.12 75.57,35.56 arc90 74.93,36.2 69.85,36.2 arc90 69.22,35.56 69.22,31.12 arc90 69.85,29.84 74.93,29.84 arc90
I2C1_SCL  (4 unrouted)
I2C1_SDA  (4 unrouted)
I2C3_SCL  (2 unrouted)
I2C3_SDA  (2 unrouted)
LIDAR_POS_INT  (1 unrouted)
M_LB_IN1  (1 unrouted)
M_LB_IN2  (1 unrouted)
M_LF_IN1  (1 unrouted)
M_LF_IN2  (1 unrouted)
M_PWM_LB  (2 unrouted)
M_PWM_LF  (2 unrouted)
M_PWM_RB  (2 unrouted)
  Top 0.305: U1.5 26.64,34.48 26.26,34.86 26.26,38
M_PWM_RF  (2 unrouted)
  Top 0.305: U1.4 27.02,34.98 26.72,35.28 26.72,37.74
M_RB_IN1  (1 unrouted)
M_RB_IN2  (1 unrouted)
M_RF_IN1  (1 unrouted)
M_RF_IN2  (1 unrouted)
M_SLEEP  (2 unrouted)
N$1
  Top 0.406: C21.2 71.34,20.54 IC2.2
N$2
  Top 0.406: IC2.1 70.7,19.48 C21.1
N$3
  Top 0.406: IC2.3 72.01,19.44 72.39,19.05 72.39,17.23 C22.1
N$4
  Top 0.406: P2.1 83.57,10.62 83.57,14.22 80.65,17.15 78.49,17.15 76.56,19.08 IC2.10
N$5  (2 unrouted)
N$6  (1 unrouted)
N$7  (1 unrouted)
N$8
  Top 0.254: U3.10 69.44,32.82 C7.1
N$9  (1 unrouted)
N$10  (2 unrouted)
N$11
  Top 0.406: P4.1 69.55,14.22 73.97,14.22 74.3,14.55 74.3,17.15 73.51,17.93 73.51,19.51 73.31,19.72 IC2.5
N$12
  Top 0.406: IC2.7 74.61,18.54 75.13,18.01 75.13,16.23 76.76,14.61 P4.6
N$13
  Top 0.305: U1.13 25.4,30.48 24.93,30.01 C11.2 21.89,30.01 ABM8G-25.000MHZ-18-D2Y-T3.1
N$14
  Top 0.406: IC1.5 54.89,18.08 55.63,17.35 55.63,15.62 53.64,13.64 50.55,13.64 P3.1
N$15  (1 unrouted)
N$16
  Top 0.305: U1.94 32.56,39.3 R7.1
N$17  (1 unrouted)
N$18
  Top 0.406: C2.2 52.94,18.75 IC1.2
N$19
  Top 0.406: IC2.8 75.26,19 81.24,13.02 77.04,8.81 71.76,8.81 P2.6
N$20
  Top 0.406: 51.03,18.41 C2.1 51.02,18.41 52.29,19.69 | IC1.1 52.29,19.69 | 52.29,19.69 52.29,19.68 52.12,19.51
N$21
  Top 0.406: IC1.3 53.59,17.01 C3.1
N$22  (1 unrouted)
N$23  (1 unrouted)
N$24  (1 unrouted)
N$25  (1 unrouted)
N$26
  Top 0.508: IC2.15 79.16,28.43 C25.1
N$27
  Top 0.406: IC1.7 56.19,18.18 57.4,16.97 57.4,16.05 58.34,15.12 P3.6
N$28
  Top 0.406: IC1.8 56.84,19.13 61.06,14.91 61.06,8.08 52.61,8.08 P1.6
N$29
  Top 0.406: IC1.15 C4.1
N$30
  Top 0.406: IC1.10 58.14,19.33 61.62,15.85 62.43,15.85 62.43,4.65 61.59,3.81 P1.1
N$31  (1 unrouted)
N$32  (4 unrouted)
N$33  (1 unrouted)
N$34  (1 unrouted)
N$35  (1 unrouted)
N$36  (1 unrouted)
N$37  (1 unrouted)
  Top 0.406: M2.1 12.32,46.66 13.86,46.66 R22.2
N$38  (1 unrouted)
  Top 0.508: M1.1 69.54,43.28 R9.2
N$39  (1 unrouted)
  Top 0.813: D1.A 74.64,46.16 LIDAR_MOTOR.P1
N$40  (5 unrouted)
N$44
  Top 0.305: U1.12 25.41,30.98 24.9,31.48 C12.2 19.86,31.48 ABM8G-25.000MHZ-18-D2Y-T3.3
N$45
  Top 0.305: U1.73 46.3,35.48 C32.2
N$55
  Top 0.813: FAN.P2 7.13,46.64 D3.A M2.3
NFAULT  (2 unrouted)
  Top 0.305: U1.80 39.56,40.05 R20.1
NRST  (2 unrouted)
PWM_FAN  (1 unrouted)
PWM_LIDAR  (1 unrouted)
PWM_LIGHT  (1 unrouted)
SWCLK  (1 unrouted)
SWDIO  (1 unrouted)
TEMPERATURE  (2 unrouted)
UART3_RX  (1 unrouted)
UART3_TX  (1 unrouted)
UART4_RX  (1 unrouted)
UART4_TX  (1 unrouted)
USB_OTG_DM  (1 unrouted)
USB_OTG_DP  (1 unrouted)
USB_OTG_ID  (1 unrouted)
V+  (5 unrouted)
(copper drawn outside any net)
  shapes: Top area x2

### Text on the board
tNames: + | - + | - | 5v I1 I2 GND
bNames: 5v GND SDA SCL | ζ2 Motherboard